# EAGLE design Connection (EAGLE 9.6.2)
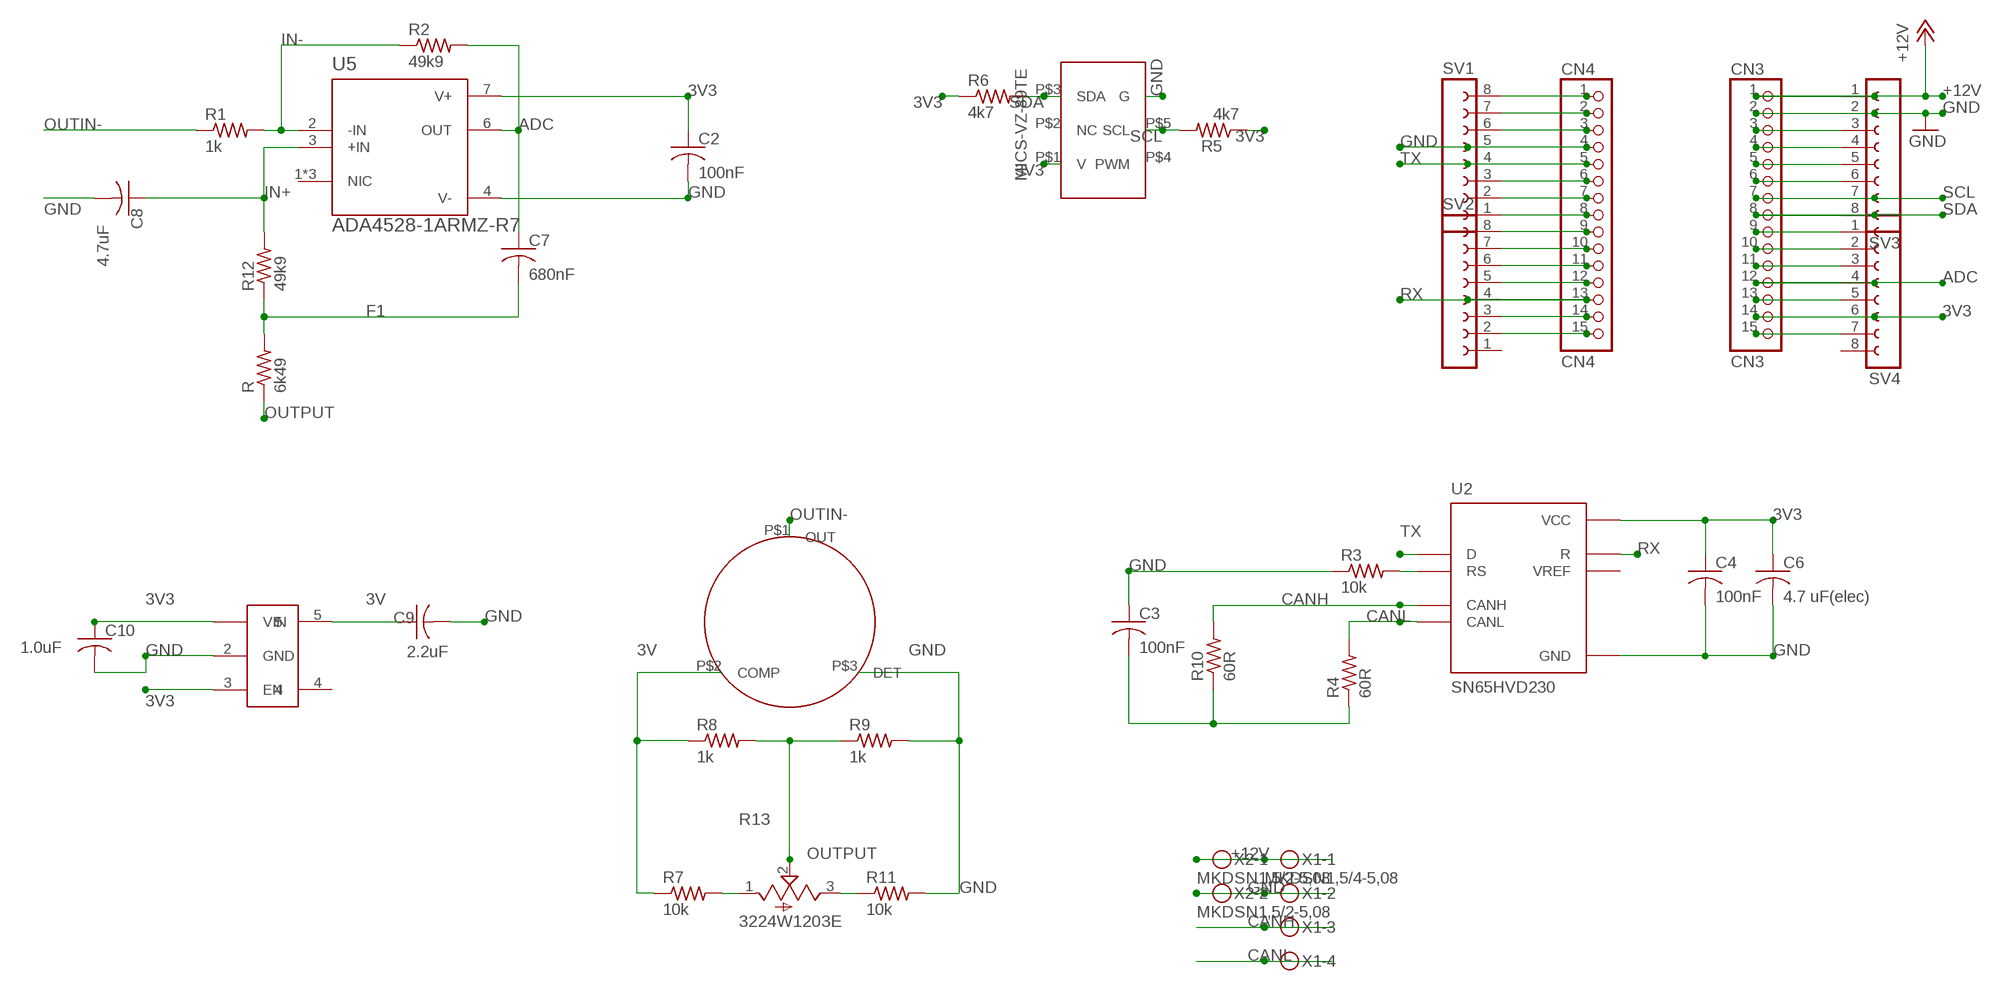
[diagram p0: schematic, sheet 1]

## Parts
C2  100nF  C-USC0402  [C0402]
C3  100nF  C-USC0402  [C0402]
C4  100nF  C-USC0402  [C0402]
C6  4.7 uF(elec)  C-USC0603  [C0603]
C7  680nF  C-USC1206  [C1206]
C8  4.7uF  C-USC1206  [C1206]
C9  2.2uF  C-USC0603  [C0603]
C10  1.0uF  C-USC0805  [C0805]
CN3  CN3  PINHD-1X15  [1X15]
CN4  CN4  PINHD-1X15  [1X15]
R  6k49  R-US_R0603  [R0603]
R1  1k  R-US_R0805  [R0805]
R2  49k9  R-US_R0603  [R0603]
R3  10k  R-US_M1206  [M1206]
R4  60R  R-US_R0603  [R0603]
R5  4k7  R-US_M1206  [M1206]
R6  4k7  R-US_M1206  [M1206]
R7  10k  R-US_M1206  [M1206]
R8  1k  R-US_R0805  [R0805]
R9  1k  R-US_R0805  [R0805]
R10  60R  R-US_R0603  [R0603]
R11  10k  R-US_M1206  [M1206]
R12  49k9  R-US_R0603  [R0603]
R13  3224W1203E  [TRIM_3224W1203E]
SV1  FE08-1  [FE08]
SV2  FE08-1  [FE08]
SV3  FE08-1  [FE08]
SV4  FE08-1  [FE08]
U2  SN65HVD230  [SOIC127P599X175-8N]
U5  ADA4528-1ARMZ-R7  [SOP65P490X110-8N]
U$1  MP7227  [MP7227_FP]
U$3  MIC5233  [MIC5233]
U$4  MICS-VZ-89TE  [MICS-VZ-89TE_FP]
X1  MKDSN1,5/4-5,08  [MKDSN1,5/4-5,08]
X2  MKDSN1,5/2-5,08  [MKDSN1,5/2-5,08]

## Nets
3V: C9.1 R7.1 R8.1 U$1.P$2(COMP) U$3.5
3V3: C2.1 C4.1 C6.1 C10.1 CN3.14 R5.1 R6.1 SV4.6 U2.3(VCC) U5.7(V+) U$3.1(VIN) U$3.3(EN) U$4.P$1(V)
+12V: CN3.1 SV3.1 X1.1 X2.1
ADC: C7.1 CN3.12 R2.2 SV4.4 U5.6(OUT)
C1: C3.2 R4.1 R10.1
CANH: R10.2 U2.7(CANH) X1.3
CANL: R4.2 U2.6(CANL) X1.4
F1: C7.2 R12.1 R.2
GND: C2.2 C3.1 C4.2 C6.2 C8.2 C9.2 C10.2 CN3.2 CN4.4 R3.1 R9.2 R11.2 SV1.5 SV3.2 U2.2(GND) U5.4(V-) U$1.P$3(DET) U$3.2(GND) U$4.P$6(G) X1.2 X2.2
IN+: C8.1 R12.2 U5.3(+IN)
IN-: R1.2 R2.1 U5.2(-IN)
N$6: CN3.6 SV3.6
N$18: CN3.3 SV3.3
N$19: CN3.4 SV3.4
N$20: CN3.5 SV3.5
N$22: CN3.9 SV4.1
N$23: CN3.10 SV4.2
N$24: CN3.11 SV4.3
N$25: CN3.13 SV4.5
N$26: CN3.15 SV4.7
N$27: CN4.8 SV1.1
N$28: CN4.7 SV1.2
N$29: CN4.6 SV1.3
N$31: CN4.3 SV1.6
N$32: CN4.2 SV1.7
N$33: CN4.1 SV1.8
N$34: CN4.15 SV2.2
N$35: CN4.14 SV2.3
N$36: CN4.12 SV2.5
N$37: CN4.11 SV2.6
N$38: CN4.10 SV2.7
N$39: CN4.9 SV2.8
OUTIN-: R1.1 U$1.P$1(OUT)
OUTPUT: R8.2 R9.1 R13.2 R.1
PL: R7.2 R13.1
PR: R11.1 R13.3
RS: R3.2 U2.8(RS)
RX: CN4.13 SV2.4 U2.4(R)
SCL: CN3.7 R5.2 SV3.7 U$4.P$5(SCL)
SDA: CN3.8 R6.2 SV3.8 U$4.P$3(SDA)
TX: CN4.5 SV1.4 U2.1(D)
Unconnected: SV2.1 SV4.8 U2.5(VREF) U5.1(NIC) U5.5(NIC) U5.8(NIC) U$3.4 U$4.P$2(NC) U$4.P$4(PWM)

## Library data of the parts
C2-C4 C6-C10 = rcl:C-US: CAPACITOR, American symbol; SPICEPREFIX: C
CN3 CN4 = pinhead:PINHD-1X15: PIN HEADER
R R1-R12 = rcl:R-US_: RESISTOR, American symbol; SPICEPREFIX: R
R13 = 3224W1203E:3224W1203E: Check availability <https://pricing.snapeda.com/parts/3224W-1-203E/Bourns/view-part?ref=eda>; AVAILABILITY: In Stock; CHECK_PRICES: https://www.snapeda.com/parts/3224W-1-203E/Bourns/view-part/?ref=eda; DESCRIPTION: Trimmer, Cermet, Rest 20 Kilohms, SMD, 11 Turn, Pwr-Rtg 0.25W | Bourns 3224W-1-203E; MF: Bourns; MP: 3224W-1-203E; PACKAGE: 3224W-1 Bourns; PRICE: None; SNAPEDA_LINK: https://www.snapeda.com/parts/3224W-1-203E/Bourns/view-part/?ref=snap
SV1-SV4 = con-lsta:FE08-1: FEMALE HEADER; OC_FARNELL: unknown; OC_NEWARK: unknown
U2 = SN65HVD230:SN65HVD230: Check availability <https://pricing.snapeda.com/parts/SN65HVD230/Texas%20Instruments/view-part?ref=eda>; AVAILABILITY: In Stock; CHECK_PRICES: https://www.snapeda.com/parts/SN65HVD230/Texas+Instruments/view-part/?ref=eda; DESCRIPTION: 1/1 Transceiver Half CANbus 8-SOIC; MF: Texas Instruments; MP: SN65HVD230; PACKAGE: SOIC-8 Texas Instruments; PRICE: None; SNAPEDA_LINK: https://www.snapeda.com/parts/SN65HVD230/Texas+Instruments/view-part/?ref=snap
U5 = ADA4528-1ARMZ-R7:ADA4528-1ARMZ-R7: Check availability <https://pricing.snapeda.com/parts/ADA4528-1ARMZ-R7/Analog%20Devices/view-part?ref=eda>; AVAILABILITY: In Stock; CHECK_PRICES: https://www.snapeda.com/parts/ADA4528-1ARMZ-R7/Analog+Devices/view-part/?ref=eda; DESCRIPTION: Precision, Ultralow Noise, RRIO, Zero-Drift Single Op Amp; MF: Analog Devices; MP: ADA4528-1ARMZ-R7; PACKAGE: MSOP-8 Analog Devices; PRICE: None; SNAPEDA_LINK: https://www.snapeda.com/parts/ADA4528-1ARMZ-R7/Analog+Devices/view-part/?ref=snap
U$1 = MP7227:MP7227
U$3 = MIC5233:MIC5233
U$4 = MICS-VZ-89TE:MICS-VZ-89TE
X1 = con-phoenix-508:MKDSN1,5/4-5,08: MKDSN 1,5/ 4-5,08 Printklemme Nennstrom: 13,5 A Nennspannung: 250 V Rastermaß: 5,08 mm Polzahl: 4 Anschlussart: Schraubanschluss Montage: Löten Anschlussrichtung Leiter/Platine: 0 ° Artikelnummer: 1729144 Source: http://eshop.phoenixcontact.com .. 1729144.pdf
X2 = con-phoenix-508:MKDSN1,5/2-5,08: MKDSN 1,5/ 2-5,08 Printklemme Nennstrom: 13,5 A Nennspannung: 250 V Rastermaß: 5,08 mm Polzahl: 2 Anschlussart: Schraubanschluss Montage: Löten Anschlussrichtung Leiter/Platine: 0 ° Artikelnummer: 1729128 Source: http://eshop.phoenixcontact.com .. 1729128.pdf

## Board
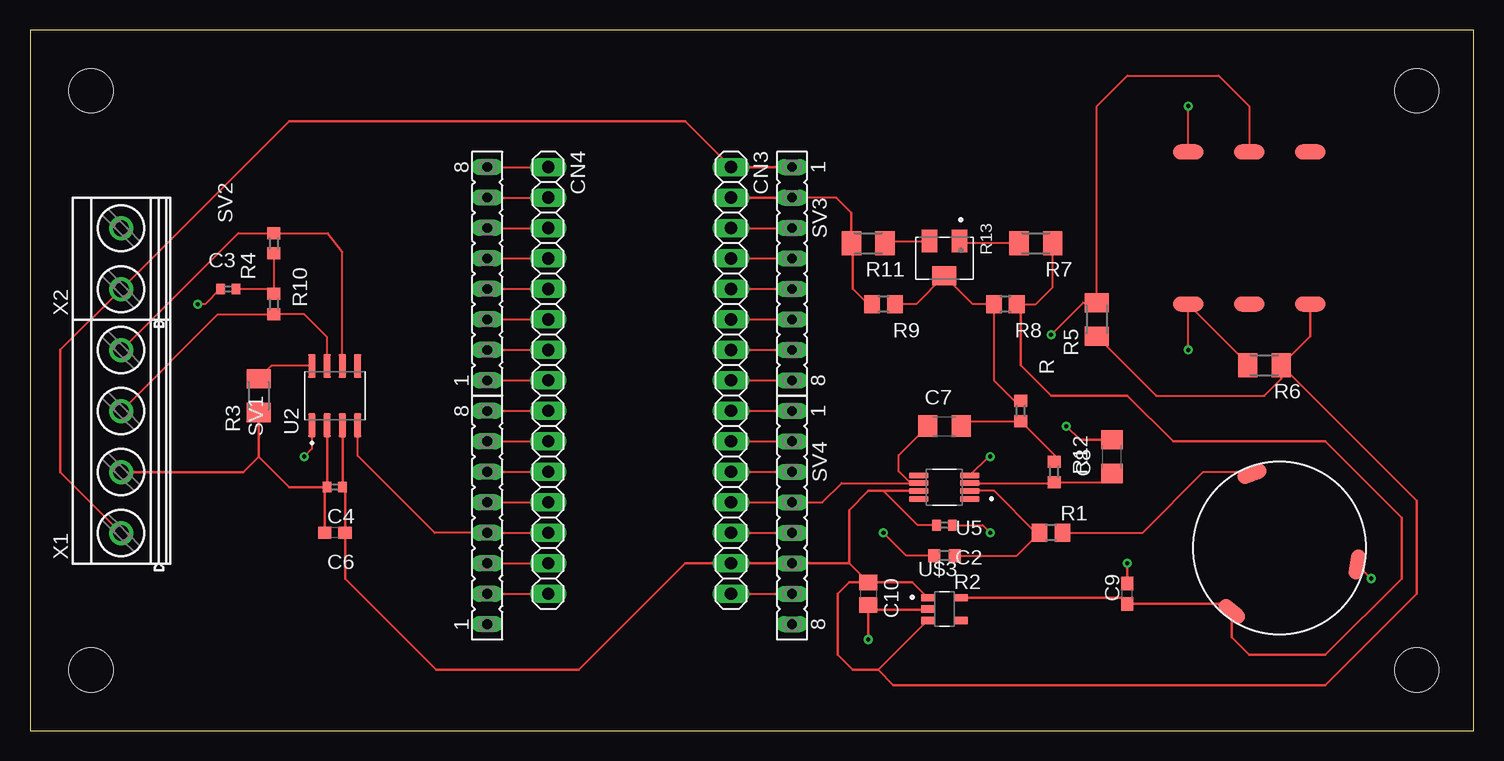
[diagram p1: board, top side]
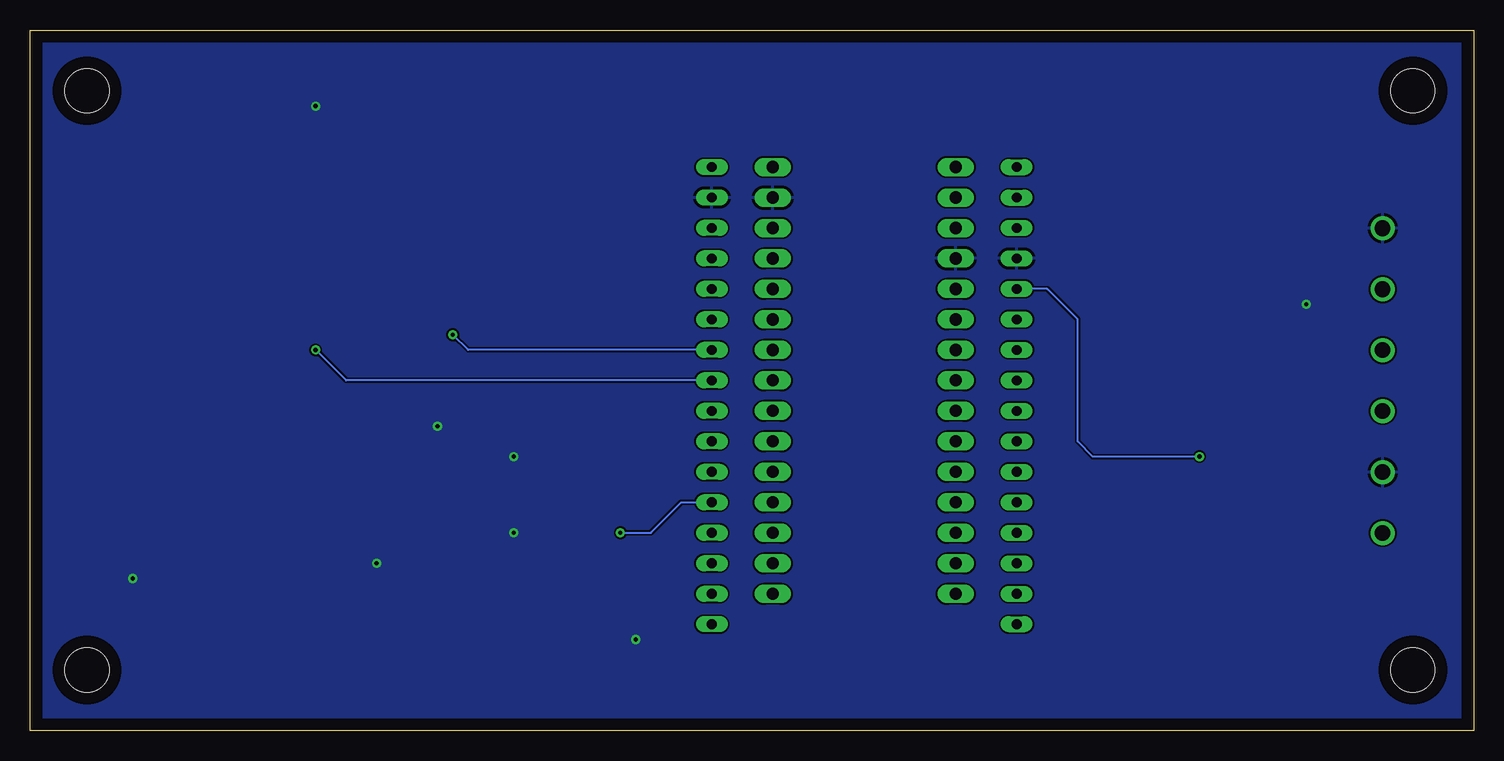
[diagram p2: board, bottom side, seen from below]

Size 120.32 x 58.41 mm. Coordinates in mm from the lower left corner, seen from the top.
Outline: 0,0 120.32,0 120.32,58.41 0,58.41 0,0
Copper layers (1*16): Top 0.035mm / dielectric 1.5mm / Bottom 0.035mm
Design rules "default": minimum track width 6mil, minimum drill 0.35mm, track to track 6mil, track to pad 6mil, pad to pad 6mil, via to via 6mil, smd to smd 6mil, copper to edge 40mil, drill to drill 6mil, minimum pad ring 10mil, minimum via ring 8mil, stop-mask expansion 4mil, vias tented up to drill 0mil, thermal gap 10mil
Holes 3.66 mm at 5.08,53.34 5.08,5.08 115.57,5.08 115.57,53.34

### Footprints (pad centres in the part's own frame; a part is rotated, then mirrored left to right if it is on the bottom)
C0402 = smd 0.7 x 0.9: 1 -0.65,0; 2 0.65,0
C0603 = smd 1.1 x 1: 1 -0.85,0; 2 0.85,0
C1206 = smd 1.6 x 1.8: 1 -1.4,0; 2 1.4,0
C0805 = smd 1.3 x 1.5: 1 -0.95,0; 2 0.95,0
1X15 = drill 1.016 long: 1 -17.78,0; 2 -15.24,0; 3 -12.7,0; 4 -10.16,0; 5 -7.62,0; 6 -5.08,0; 7 -2.54,0; 8 0,0; 9 2.54,0; 10 5.08,0; 11 7.62,0; 12 10.16,0; 13 12.7,0; 14 15.24,0; 15 17.78,0
R0603 = smd 1 x 1.1: 1 -0.85,0; 2 0.85,0
R0805 = smd 1.3 x 1.5: 1 -0.95,0; 2 0.95,0
M1206 = smd 1.6 x 2: 1 -1.4,0; 2 1.4,0
TRIM_3224W1203E = smd 1.9 x 1.3: 1 -1.45,1.25; 3 -1.45,-1.25 | smd 1.6 x 2: 2 1.45,0
FE08 = drill 0.813 long: 1 -8.89,0; 2 -6.35,0; 3 -3.81,0; 4 -1.27,0; 5 1.27,0; 6 3.81,0; 7 6.35,0; 8 8.89,0
SOIC127P599X175-8N = smd 1.97 x 0.6: 1 -2.47,1.905; 2 -2.47,0.635; 3 -2.47,-0.635; 4 -2.47,-1.905; 5 2.47,-1.905; 6 2.47,-0.635; 7 2.47,0.635; 8 2.47,1.905
SOP65P490X110-8N = smd 1.62 x 0.5: 1 -2.12,0.975; 2 -2.12,0.325; 3 -2.12,-0.325; 4 -2.12,-0.975; 5 2.12,-0.975; 6 2.12,-0.325; 7 2.12,0.325; 8 2.12,0.975
MP7227_FP = smd 2.54 x 1.27: P$1 0,6.604 | smd 2.54 x 1.27 rotated 120: P$2 -5.588,-3.556 | smd 2.54 x 1.27 rotated 60: P$3 5.588,-3.556
MIC5233 = smd 1.1 x 0.6: 1 -1.4,0.95; 2 -1.4,0; 3 -1.4,-0.95; 4 1.4,-0.95; 5 1.4,0.95
MICS-VZ-89TE_FP = smd 2.54 x 1.27: P$1 0,0; P$2 5.08,0; P$3 10.16,0; P$4 0,-12.7; P$5 5.08,-12.7; P$6 10.16,-12.7
MKDSN1,5/4-5,08 = drill 1.3 pad 2: 1 -7.641,0.025; 2 -2.561,0.025; 3 2.519,0.025; 4 7.599,0.025
MKDSN1,5/2-5,08 = drill 1.3 pad 2: 1 -2.561,0.025; 2 2.519,0.025

### Placement (x,y rotation side)
C2  76.2,17.14 0 top
C3  16.51,36.83 0 top
C4  25.4,20.32 180 top
C6  25.4,16.51 180 top
C7  76.2,25.4 0 top
C8  90.17,22.86 90 top
C9  91.44,11.43 90 top
C10  69.85,11.43 270 top
CN3  58.42,29.21 270 top
CN4  43.18,29.21 270 top
R  82.55,26.67 270 top
R1  85.09,16.51 180 top
R2  76.2,14.61 180 top
R3  19.05,27.94 90 top
R4  20.32,40.64 90 top
R5  88.9,34.29 90 top
R6  102.87,30.48 180 top
R7  83.82,40.64 180 top
R8  81.28,35.56 180 top
R9  71.12,35.56 180 top
R10  20.32,35.56 270 top
R11  69.85,40.64 180 top
R12  85.34,21.59 270 top
R13  76.2,39.37 270 top
SV1  38.1,38.1 90 top
SV2  38.1,17.78 90 top
SV3  63.5,38.1 270 top
SV4  63.5,17.78 270 top
U2  25.4,27.94 90 top
U5  76.2,20.32 180 top
U$1  104.14,15.24 20.5 top
U$3  76.2,10.16 0 top
U$4  106.68,35.56 180 top
X1  7.62,24.13 90 top
X2  7.62,39.37 90 top

### Tracks (layer width: path | path; a pad name or v marks a point on that pad's centre or on a via)
3V
  Top 0.152: C9.1 91.55,10.55 | R8.1 83.82,35.56 85.22,36.96 R7.1
  Top 0.203: U$3.5 90.99,11.11 91.55,10.55 | C9.1 99.52,10.58 100.14,9.97 | 100.14,9.97 U$1.P$2 | R8.1 82.55,35.24 82.55,30.48 85.09,27.94 91.44,27.94 95.25,24.13 107.95,24.13 114.3,17.78 114.3,12.7 107.95,6.35 101.6,6.35 100.14,7.81 100.14,9.97
3V3
  Top 0.152: 26.05,25.45 U2.3 | 26.25,20.12 C4.1 | C2.1 73.97,17.14 71.12,20 | 93.85,27.94 102.87,27.94
  Top 0.203: C4.1 26.05,25.45 | 26.25,20.12 C6.1 26.25,12.7 33.87,5.08 45.72,5.08 54.61,13.97 CN3.14 SV4.6 68.26,13.97 | C10.1 73.53,12.38 U$3.1 | 68.26,13.97 C10.1 | U$3.3 70.67,5.08 | 70.67,5.08 68.58,5.08 67.31,6.35 67.31,11.43 68.26,12.38 C10.1 | R6.1 106.68,32.89 U$4.P$1 | 102.87,27.94 104.27,29.34 R6.1 | R5.1 93.85,27.94 | U5.7 71.12,20 69.85,20 68.26,18.41 68.26,13.97 | R6.1 115.57,19.18 115.57,11.43 107.95,3.81 71.94,3.81 70.67,5.08
+12V
  Top 0.203: SV3.1 CN3.1 54.61,50.8 21.59,50.8 X2.1 2.54,31.75 2.54,21.54 X1.1
ADC  (via drill 0.35)
  Top 0.152: CN3.12 SV4.4 66.04,19.05 67.64,20.64 U5.6 73.91,20.82 73.21,20.82 72.39,21.64 72.39,22.99 C7.1 | R2.2 73.03,14.61 v71.12,16.51
  Bottom 0.152: v71.12,16.51 68.58,16.51 66.04,19.05 SV4.4
C1
  Top 0.152: R4.1 R10.1 19.9,36.83 C3.2
CANH
  Top 0.152: U2.7 24.77,32.8 22.86,34.71 R10.2 15.66,34.71 X1.3
CANL
  Top 0.152: U2.6 26.04,39.91 24.82,41.49 R4.2 17.36,41.49 X1.4
F1
  Top 0.152: C7.2 78.02,25.82 R.2 85.34,23.03 R12.1
GND  (via drill 0.35)
  Top 0.152: 74.86,10.1 U$3.2 | 24.75,25.45 U2.2 | 24.55,20.12 C4.2 | 24.55,18.63 C6.2 | SV1.5 CN4.4 | 67.18,44.45 SV3.2 | U$4.P$6 v96.52,52.07 | U5.4 79.89,22.86 v80.01,22.86 | C2.2 79.38,17.14 v80.01,16.51 | C3.1 14.59,35.56 v13.97,35.56
  Top 0.203: 24.75,25.45 C4.2 21.59,20.32 19.05,22.86 | C6.2 24.55,20.12 | CN3.2 SV3.2 | R3.1 19.05,22.86 | X1.2 17.76,21.57 19.05,22.86 | 67.18,44.45 68.45,43.18 R11.2 68.58,40.51 68.58,36.83 69.85,35.56 R9.2 | v91.44,13.97 C9.2 | U$1.P$3 110.62,13.84 v111.76,12.7 | 74.86,10.1 70.23,10.1 C10.2 v69.85,7.62 | C8.2 87.5,24.26 v86.36,25.4
  pour Bottom: 0,58.42 0,0 120.65,0 120.65,58.42
IN+
  Top 0.152: U5.3 84.87,20.64 R12.2 89.84,20.74 C8.1
IN-
  Top 0.152: R2.1 82.23,14.61 R1.2 83.82,16.51 80.33,20 U5.2
N$6
  Top 0.152: CN3.6 SV3.6
N$18
  Top 0.152: CN3.3 SV3.3
N$19
  Top 0.152: CN3.4 SV3.4
N$20
  Top 0.152: CN3.5 SV3.5
N$22
  Top 0.152: CN3.9 SV4.1
N$23
  Top 0.152: CN3.10 SV4.2
N$24
  Top 0.152: CN3.11 SV4.3
N$25
  Top 0.152: CN3.13 SV4.5
N$26
  Top 0.152: CN3.15 SV4.7
N$27
  Top 0.152: SV1.1 CN4.8
N$28
  Top 0.152: SV1.2 CN4.7
N$29
  Top 0.152: SV1.3 CN4.6
N$31
  Top 0.152: SV1.6 CN4.3
N$32
  Top 0.152: SV1.7 CN4.2
N$33
  Top 0.152: SV1.8 CN4.1
N$34
  Top 0.152: SV2.2 CN4.15
N$35
  Top 0.152: SV2.3 CN4.14
N$36
  Top 0.152: SV2.5 CN4.12
N$37
  Top 0.152: SV2.6 CN4.11
N$38
  Top 0.152: SV2.7 CN4.10
N$39
  Top 0.152: SV2.8 CN4.9
OUTIN-
  Top 0.152: R1.1 92.71,16.51 97.79,21.59 101.66,21.59 U$1.P$1
OUTPUT
  Top 0.152: R9.1 73.84,35.56 R13.2 78.56,35.56 R8.2 80.33,29.21 82.02,27.52 R.1
PL
  Top 0.152: R7.2 77.63,40.64 R13.1
PR
  Top 0.152: R11.1 71.43,40.82 R13.3
RS
  Top 0.152: U2.8 20.12,30.41 R3.2
RX
  Top 0.152: CN4.13 SV2.4 33.73,16.51 27.3,22.93 U2.4
SCL  (via drill 0.35)
  Top 0.152: CN3.7 SV3.7 | v85.09,33.02 87.76,35.69 R5.2 88.9,52.07 91.44,54.61 99.06,54.61 101.6,52.07 U$4.P$5
  Bottom 0.152: SV3.7 83.82,31.75 v85.09,33.02
SDA  (via drill 0.35)
  Top 0.152: CN3.8 SV3.8 | v96.52,31.75 U$4.P$3 101.47,30.61 R6.2
  Bottom 0.152: SV3.8 93.98,29.21 v96.52,31.75
TX  (via drill 0.35)
  Top 0.152: SV1.4 CN4.5 | U2.1 23.5,23.5 v22.86,22.86
  Bottom 0.152: v22.86,22.86 31.75,22.86 33.02,24.13 33.02,34.29 35.56,36.83 SV1.4